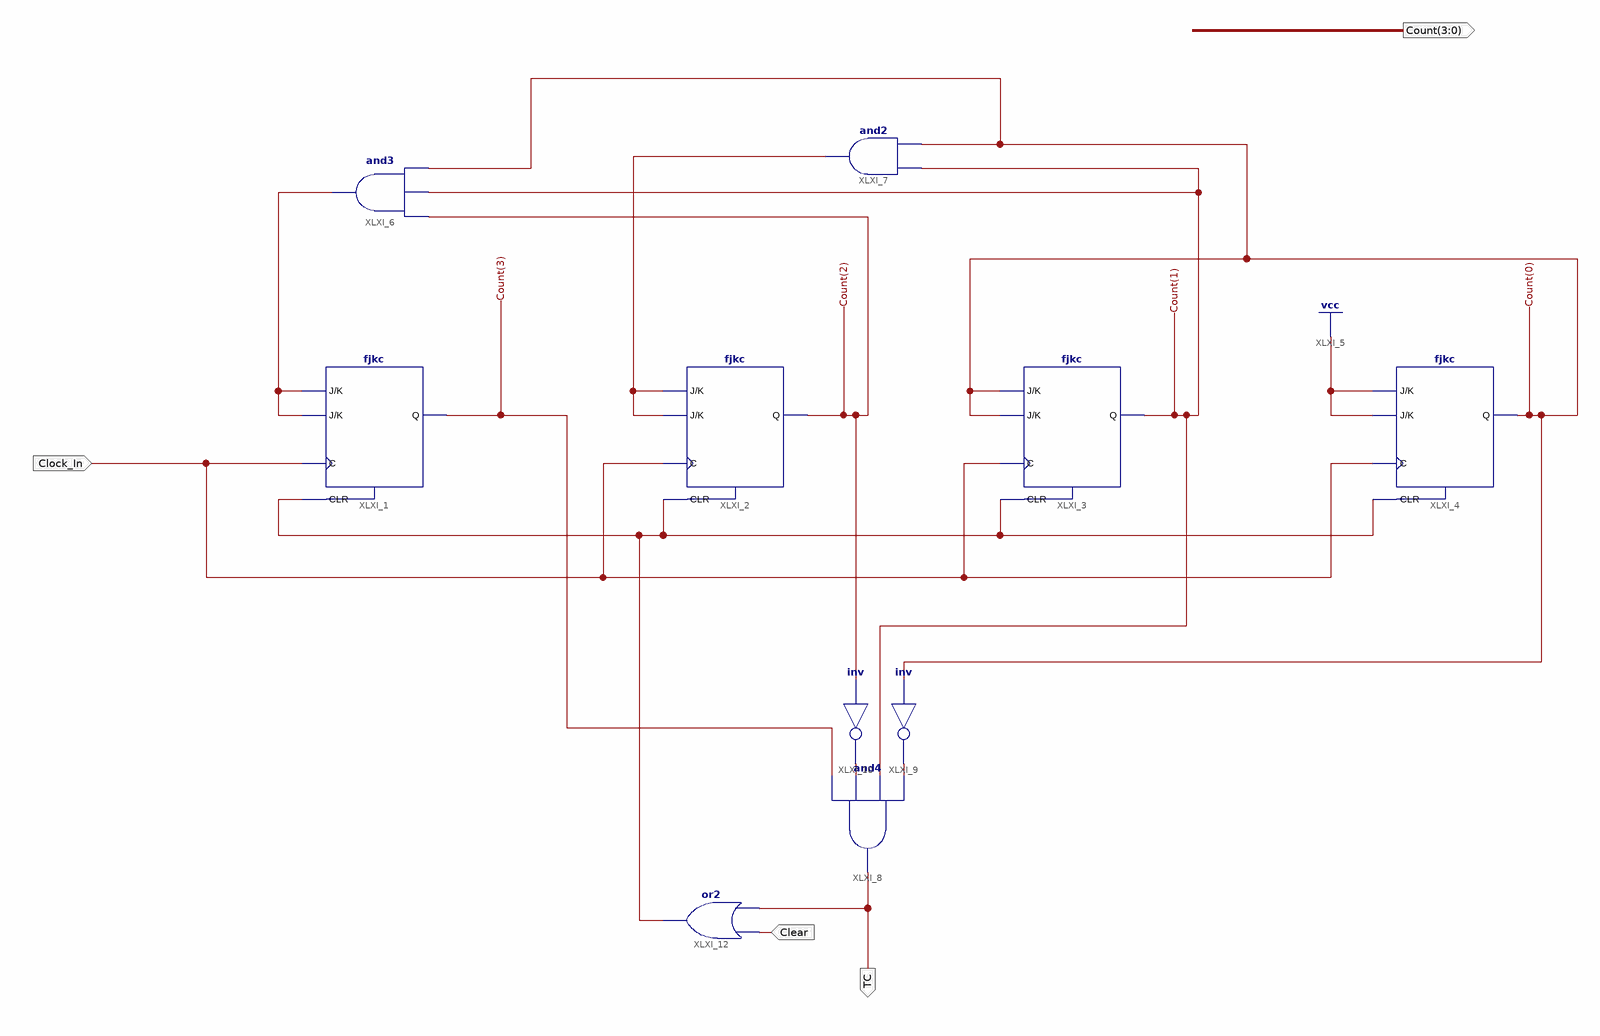
[diagram p0: schematic sheet 1]
// Xilinx ISE schematic Counter0_9NEW.sch (spartan6) as structural Verilog: 10 symbols, 4 ports
module Counter0_9NEW (
  input  Clock_In,
  input  Clear,
  output TC,
  output [3:0] Count
);

  wire XLXN_2, XLXN_5, XLXN_10, XLXN_13, XLXN_14;

  fjkc XLXI_1 (.C(Clock_In), .CLR(XLXN_10), .J(XLXN_2), .K(XLXN_2), .Q(Count[3]));
  fjkc XLXI_2 (.C(Clock_In), .CLR(XLXN_10), .J(XLXN_5), .K(XLXN_5), .Q(Count[2]));
  fjkc XLXI_3 (.C(Clock_In), .CLR(XLXN_10), .J(Count[0]), .K(Count[0]), .Q(Count[1]));
  fjkc XLXI_4 (.C(Clock_In), .CLR(XLXN_10), .J(1'b1), .K(1'b1), .Q(Count[0]));
  and XLXI_6 (XLXN_2, Count[2], Count[1], Count[0]);
  and XLXI_7 (XLXN_5, Count[1], Count[0]);
  and XLXI_8 (TC, Count[3], XLXN_13, Count[1], XLXN_14);
  not XLXI_9 (XLXN_14, Count[0]);
  not XLXI_10 (XLXN_13, Count[2]);
  or XLXI_12 (XLXN_10, Clear, TC);
endmodule
